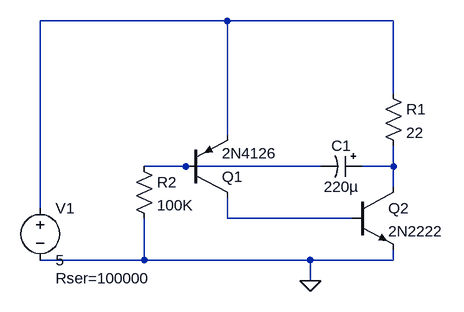
[diagram p0: schematic BatteryLoad.asc]
BatteryLoad.asc, the LTspice schematic file:
Version 4
SHEET 1 880 680
WIRE -32 -160 -320 -160
WIRE 224 -160 -32 -160
WIRE 224 -48 224 -160
WIRE -32 16 -32 -160
WIRE -96 64 -160 64
WIRE 112 64 -96 64
WIRE 224 64 224 32
WIRE 224 64 176 64
WIRE 224 96 224 64
WIRE -320 128 -320 -160
WIRE -32 144 -32 112
WIRE 160 144 -32 144
WIRE -160 208 -160 144
WIRE -160 208 -320 208
WIRE 96 208 -160 208
WIRE 224 208 224 192
WIRE 224 208 96 208
WIRE 96 240 96 208
FLAG 96 240 0
SYMBOL polcap 176 48 R90
WINDOW 0 0 32 VBottom 2
WINDOW 3 32 32 VTop 2
SYMATTR InstName C1
SYMATTR Value 220µ
SYMATTR Description Capacitor
SYMATTR Type cap
SYMATTR SpiceLine V=16 Irms=460m Rser=0.16 Lser=0 mfg="Nichicon" pn="UPL1C221MPH" type="Al electrolytic"
SYMBOL pnp -96 112 M180
SYMATTR InstName Q1
SYMATTR Value 2N4126
SYMBOL res 208 -64 R0
SYMATTR InstName R1
SYMATTR Value 22
SYMATTR SpiceLine tol=5 pwr=0.1
SYMBOL res -176 48 R0
SYMATTR InstName R2
SYMATTR Value 100K
SYMATTR SpiceLine tol=5 pwr=0.25
SYMBOL voltage -320 112 R0
WINDOW 123 0 0 Left 2
WINDOW 39 24 124 Left 2
SYMATTR InstName V1
SYMATTR Value 5
SYMATTR SpiceLine Rser=100000
SYMBOL npn 160 96 R0
SYMATTR InstName Q2
SYMATTR Value 2N2222

The netlist it stands for:
* BatteryLoad.asc
C1 N003 N002 220µ V=16 Irms=460m Rser=0.16 Lser=0 mfg="Nichicon" pn="UPL1C221MPH" type="Al electrolytic"
Q1 N004 N002 N001 0 2N4126
R1 N001 N003 22 tol=5 pwr=0.1
R2 N002 0 100K tol=5 pwr=0.25
V1 N001 0 5 Rser=100000
Q2 N003 N004 0 0 2N2222
.model NPN NPN
.model PNP PNP
.lib standard.bjt
.backanno
.end